# EAGLE design Embedded (EAGLE 9.6.2)
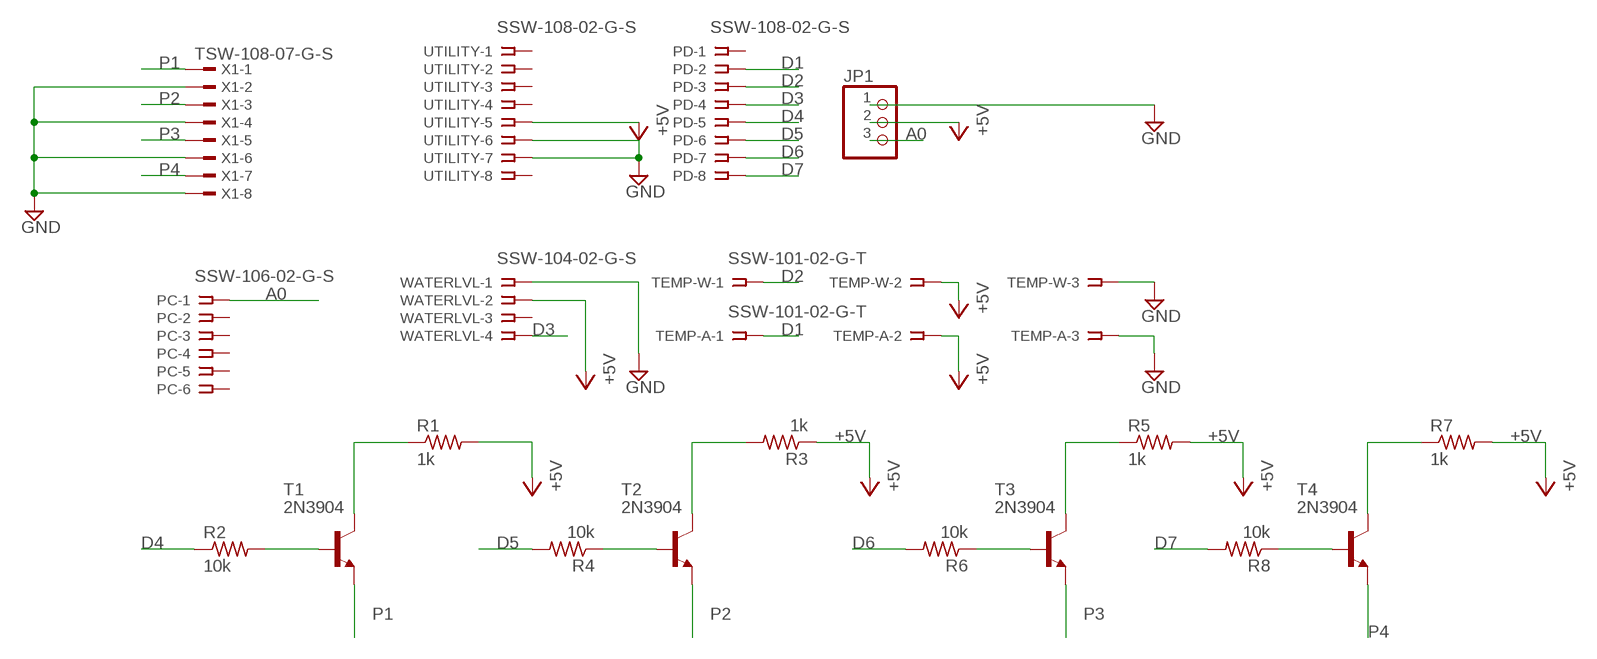
[diagram p0: schematic, sheet 1]

## Parts
JP1  PINHD-1X3  [1X03]
PC  SSW-106-02-G-S  [SSW-106-02-G-S]
PD  SSW-108-02-G-S  [SSW-108-02-G-S]
R1  1k  RESISTOR  [0411/15]
R2  10k  RESISTOR  [0411/15]
R3  1k  RESISTOR  [0411/15]
R4  10k  RESISTOR  [0411/15]
R5  1k  RESISTOR  [0411/15]
R6  10k  RESISTOR  [0411/15]
R7  1k  RESISTOR  [0411/15]
R8  10k  RESISTOR  [0411/15]
T1  2N3904  [TO92]
T2  2N3904  [TO92]
T3  2N3904  [TO92]
T4  2N3904  [TO92]
TEMP-A  SSW-101-02-G-T  [SSW-101-02-G-T]
TEMP-W  SSW-101-02-G-T  [SSW-101-02-G-T]
UTILITY  SSW-108-02-G-S  [SSW-108-02-G-S]
WATERLVL  SSW-104-02-G-S  [SSW-104-02-G-S]
X1  TSW-108-07-G-S  [TSW-108-XX-G-S]

## Nets
+5V: JP1.2 R1.2 R3.1 R5.2 R7.2 TEMP-A.2 TEMP-W.2 UTILITY.5 WATERLVL.2
A0: JP1.3 PC.1
D1: PD.2 TEMP-A.1
D2: PD.3 TEMP-W.1
D3: PD.4 WATERLVL.4
D4: PD.5 R2.1
D5: PD.6 R4.2
D6: PD.7 R6.2
D7: PD.8 R8.2
GND: JP1.1 TEMP-A.3 TEMP-W.3 UTILITY.6 UTILITY.7 WATERLVL.1 X1.2 X1.4 X1.6 X1.8
N$1: R2.2 T1.2(B)
N$2: R1.1 T1.1(C)
N$6: R4.1 T2.2(B)
N$7: R3.2 T2.1(C)
N$11: R6.1 T3.2(B)
N$12: R5.1 T3.1(C)
N$16: R8.1 T4.2(B)
N$17: R7.1 T4.1(C)
P1: T1.3(E) X1.1
P2: T2.3(E) X1.3
P3: T3.3(E) X1.5
P4: T4.3(E) X1.7
Unconnected: PC.2 PC.3 PC.4 PC.5 PC.6 PD.1 UTILITY.1 UTILITY.2 UTILITY.3 UTILITY.4 UTILITY.8 WATERLVL.3

## Library data of the parts
JP1 = pinhead:PINHD-1X3: PIN HEADER
PC = con-samtec:SSW-106-02-G-S: THROUGH-HOLE .025" SQ POST SOCKET Source: Samtec SSW.pdf; MF: Samtec Inc.; MPN: SSW-106-02-G-S; OC_FARNELL: unknown; OC_NEWARK: 11P9416
PD UTILITY = con-samtec:SSW-108-02-G-S: THROUGH-HOLE .025" SQ POST SOCKET Source: Samtec SSW.pdf; MF: Samtec Inc.; MPN: SSW-108-02-G-S; OC_FARNELL: unknown; OC_NEWARK: 11P9448
R1-R8 = ieee:RESISTOR
T1-T4 = transistor:2N3904: NPN TRANSISTOR
TEMP-A TEMP-W = con-samtec:SSW-101-02-G-T: THROUGH-HOLE .025" SQ POST SOCKET Source: Samtec SSW.pdf; MF: Samtec Inc.; MPN: SSW-101-02-G-T; OC_FARNELL: unknown; OC_NEWARK: 82P1460
WATERLVL = con-samtec:SSW-104-02-G-S: THROUGH-HOLE .025" SQ POST SOCKET Source: Samtec SSW.pdf; MF: Samtec Inc.; MPN: SSW-104-02-G-S; OC_FARNELL: unknown; OC_NEWARK: 11P9384
X1 = con-samtec:TSW-108-*-G-S: THROUGH-HOLE .025" SQ POST HEADER Source: Samtec TSW.pdf; MF: Samtec Inc.; MPN: TSW-108-07-G-S

## Board
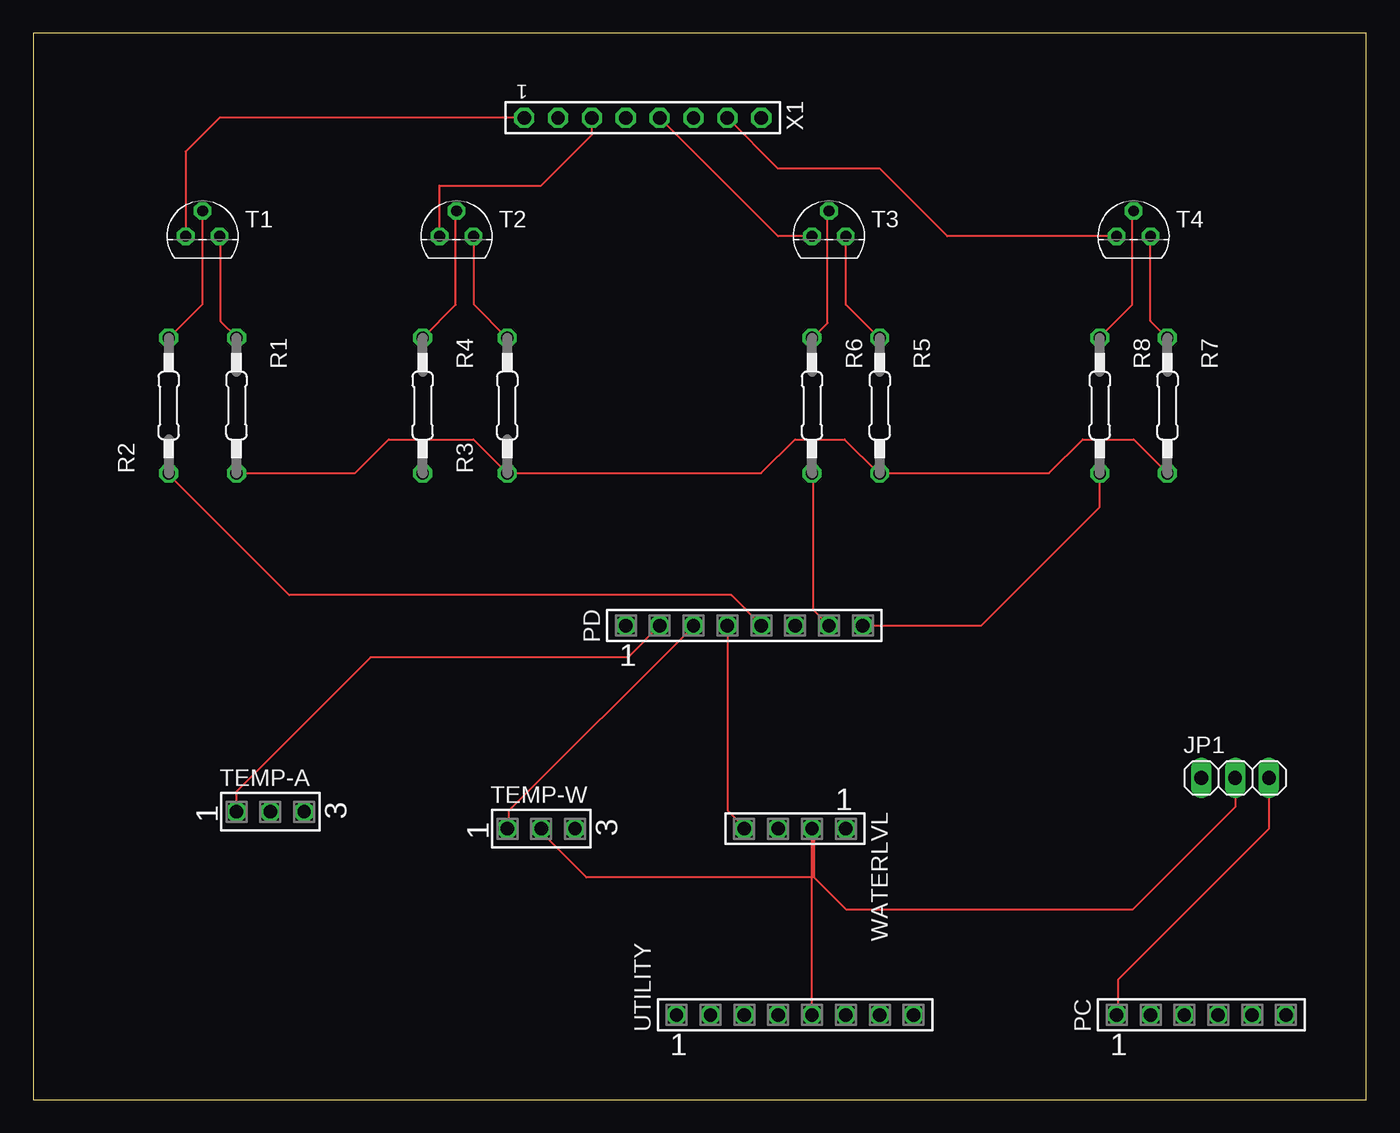
[diagram p1: board, top side]
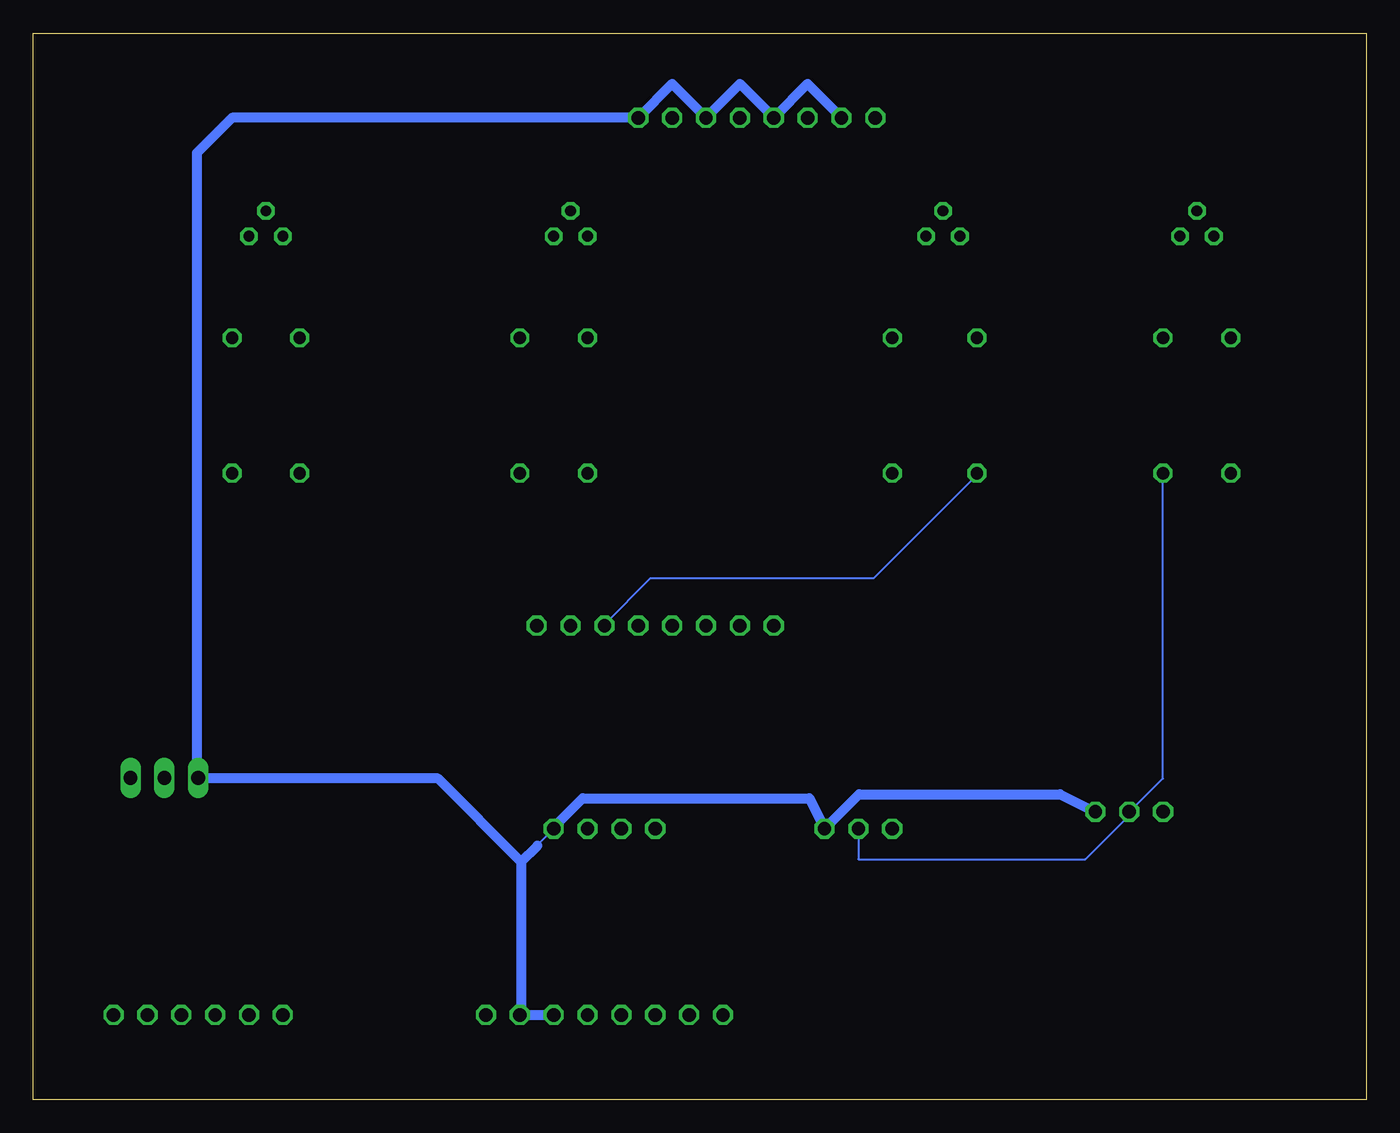
[diagram p2: board, bottom side, seen from below]

Size 100 x 80 mm. Coordinates in mm from the lower left corner, seen from the top.
Outline: 0,0 100,0 100,80 0,80 0,0
Copper layers (1*16): Top 0.035mm / dielectric 1.5mm / Bottom 0.035mm
Design rules "default *": minimum track width 6mil, minimum drill 0.35mm, track to track 6mil, track to pad 6mil, pad to pad 6mil, via to via 6mil, smd to smd 6mil, copper to edge 40mil, drill to drill 6mil, minimum pad ring 10mil, minimum via ring 8mil, stop-mask expansion 4mil, vias tented up to drill 0mil, thermal gap 10mil

### Footprints (pad centres in the part's own frame; a part is rotated, then mirrored left to right if it is on the bottom)
1X03 = drill 1.016 long: 1 -2.54,0; 2 0,0; 3 2.54,0
SSW-106-02-G-S = drill 1 pad 1.5 octagon: 1 -6.35,0; 2 -3.81,0; 3 -1.27,0; 4 1.27,0; 5 3.81,0; 6 6.35,0
SSW-108-02-G-S = drill 1 pad 1.5 octagon: 1 -8.89,0; 2 -6.35,0; 3 -3.81,0; 4 -1.27,0; 5 1.27,0; 6 3.81,0; 7 6.35,0; 8 8.89,0
0411/15 = drill 0.914 octagon: 1 -5.08,0; 2 5.08,0
TO92 = drill 0.813 octagon: 1 1.27,0; 2 0,1.905; 3 -1.27,0
SSW-101-02-G-T = drill 1 pad 1.5 octagon: 1 0,-2.54; 2 0,0; 3 0,2.54
SSW-104-02-G-S = drill 1 pad 1.5 octagon: 1 -3.81,0; 2 -1.27,0; 3 1.27,0; 4 3.81,0
TSW-108-XX-G-S = drill 1 pad 1.5 octagon: 1 8.89,0; 2 6.35,0; 3 3.81,0; 4 1.27,0; 5 -1.27,0; 6 -3.81,0; 7 -6.35,0; 8 -8.89,0

### Placement (x,y rotation side)
JP1  90.17,24.13 0 top
PC  87.63,6.35 0 top
PD  53.34,35.56 0 top
R1  15.24,52.07 270 top
R2  10.16,52.07 90 top
R3  35.56,52.07 90 top
R4  29.21,52.07 270 top
R5  63.5,52.07 270 top
R6  58.42,52.07 270 top
R7  85.09,52.07 270 top
R8  80.01,52.07 270 top
T1  12.7,64.77 0 top
T2  31.75,64.77 0 top
T3  59.69,64.77 0 top
T4  82.55,64.77 0 top
TEMP-A  17.78,21.59 270 top
TEMP-W  38.1,20.32 270 top
UTILITY  57.15,6.35 0 top
WATERLVL  57.15,20.32 180 top
X1  45.72,73.66 180 top

### Tracks (layer width: path | path; a pad name or v marks a point on that pad's centre or on a via)
+5V
  Top 0.152: TEMP-W.2 38.1,20.07 41.5,16.66 58.42,16.66 WATERLVL.2 | JP1.2 90.17,21.95 82.5,14.28 60.96,14.28 58.57,16.66 58.57,20.17 WATERLVL.2 | R1.2 24.13,46.99 26.67,49.53 33.02,49.53 R3.1 54.61,46.99 57.15,49.53 60.86,49.53 63.4,46.99 R5.2 76.2,46.99 78.74,49.53 82.55,49.53 R7.2 | UTILITY.5 WATERLVL.2
  Bottom 0.152: R1.2 15.24,24.08 17.68,21.64 TEMP-A.2 17.78,21.34 21.08,18.03 38.1,18.03 TEMP-W.2
A0
  Top 0.152: JP1.3 92.71,20.32 88.27,15.88 81.38,8.99 81.38,6.4 PC.1
D1
  Top 0.152: TEMP-A.1 15.24,23.11 25.3,33.17 44.6,33.17 PD.2
D2
  Top 0.152: TEMP-W.1 35.66,20.42 35.66,21.64 49.53,35.51 PD.3
D3
  Top 0.152: PD.4 52.12,35.51 52.12,21.64 53.34,20.42 WATERLVL.4
D4
  Top 0.152: R2.1 10.16,46.89 19.2,37.85 52.38,37.85 54.56,35.66 PD.5
D5
  Bottom 0.152: R4.2 29.21,46.84 36.93,39.12 53.7,39.12 57.15,35.66 PD.6
D6
  Top 0.152: PD.7 58.52,36.73 58.52,46.99 R6.2
D7
  Top 0.152: PD.8 71.12,35.56 80.01,44.45 R8.2
GND
  Bottom 0.152: 62.18,19.05 62.18,19.1 WATERLVL.1 60.96,20.42 | 63.4,6.4 UTILITY.7 | 87.63,24.08 JP1.1
  Bottom 0.762: TEMP-A.3 22.96,22.91 38.05,22.91 TEMP-W.3 41.78,22.61 58.78,22.61 60.96,20.42 | 63.4,17.83 63.4,6.4 | 63.4,17.83 62.18,19.05 | 63.4,17.83 69.65,24.08 87.63,24.08 87.73,24.08 87.73,71.02 85.09,73.66 X1.8 52.07,76.2 X1.6 46.99,76.2 X1.4 41.91,76.2 X1.2 | UTILITY.7 UTILITY.6
N$1
  Top 0.152: R2.2 12.7,59.69 T1.2
N$2
  Top 0.152: T1.1 14.07,64.77 14.07,58.37 15.24,57.2 R1.1
N$6
  Top 0.152: R4.1 31.7,59.64 31.7,66.65 T2.2
N$7
  Top 0.152: R3.2 33.07,59.64 33.07,64.67 T2.1
N$11
  Top 0.152: T3.2 59.59,66.65 59.59,58.27 58.52,57.2 R6.1
N$12
  Top 0.152: T3.1 60.96,59.64 63.4,57.2 R5.1
N$16
  Top 0.152: T4.2 82.45,66.65 82.45,59.64 80.01,57.2 R8.1
N$17
  Top 0.152: T4.1 83.82,58.42 R7.1
P1
  Top 0.152: X1.1 13.97,73.66 11.43,71.12 T1.3
P2
  Top 0.152: T2.3 30.48,68.58 38.1,68.58 41.91,72.39 X1.3
P3
  Top 0.152: T3.3 55.88,64.77 X1.5
P4
  Top 0.152: T4.3 68.58,64.77 63.5,69.85 55.88,69.85 X1.7